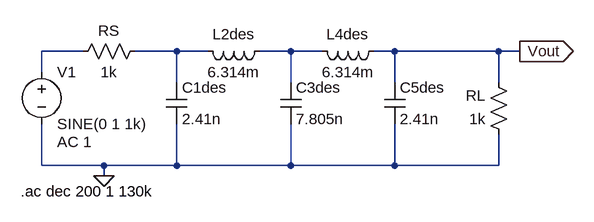
[diagram p0: schematic passabaixaslc.asc]
passabaixaslc.asc, the LTspice schematic file:
Version 4
SHEET 1 880 680
WIRE -16 128 -80 128
WIRE 128 128 64 128
WIRE 176 128 128 128
WIRE 304 128 256 128
WIRE 352 128 304 128
WIRE 464 128 432 128
WIRE 624 128 464 128
WIRE 656 128 624 128
WIRE -80 160 -80 128
WIRE 128 176 128 128
WIRE 304 176 304 128
WIRE 464 176 464 128
WIRE 624 176 624 128
WIRE -80 304 -80 240
WIRE 16 304 -80 304
WIRE 128 304 128 240
WIRE 128 304 16 304
WIRE 304 304 304 240
WIRE 304 304 128 304
WIRE 464 304 464 240
WIRE 464 304 304 304
WIRE 624 304 624 256
WIRE 624 304 464 304
WIRE 16 320 16 304
FLAG 16 320 0
FLAG 656 128 Vout
IOPIN 656 128 Out
SYMBOL res 80 112 R90
WINDOW 0 0 56 VBottom 2
WINDOW 3 32 56 VTop 2
SYMATTR InstName RS
SYMATTR Value 1k
SYMBOL res 640 272 R180
WINDOW 0 36 76 Left 2
WINDOW 3 36 40 Left 2
SYMATTR InstName RL
SYMATTR Value 1k
SYMBOL cap 112 176 R0
SYMATTR InstName C1des
SYMATTR Value 2.41n
SYMBOL cap 288 176 R0
SYMATTR InstName C3des
SYMATTR Value 7.805n
SYMBOL cap 448 176 R0
SYMATTR InstName C5des
SYMATTR Value 2.41n
SYMBOL ind 272 112 R90
WINDOW 0 5 56 VBottom 2
WINDOW 3 32 56 VTop 2
SYMATTR InstName L2des
SYMATTR Value 6.314m
SYMBOL ind 448 112 R90
WINDOW 0 5 56 VBottom 2
WINDOW 3 32 56 VTop 2
SYMATTR InstName L4des
SYMATTR Value 6.314m
SYMBOL voltage -80 144 R0
WINDOW 123 24 124 Left 2
WINDOW 39 0 0 Left 0
SYMATTR Value2 AC 1
SYMATTR InstName V1
SYMATTR Value SINE(0 1 1k)
TEXT -112 344 Left 2 !.ac dec 200 1 130k

The netlist it stands for:
* passabaixaslc.asc
RS N002 N001 1k
RL 0 Vout 1k
C1des N002 0 2.41n
C3des N003 0 7.805n
C5des Vout 0 2.41n
L2des N003 N002 6.314m
L4des Vout N003 6.314m
V1 N001 0 SINE(0 1 1k) AC 1
.ac dec 200 1 130k
.backanno
.end